# EAGLE design powerTestv1-1 (EAGLE 6.2)
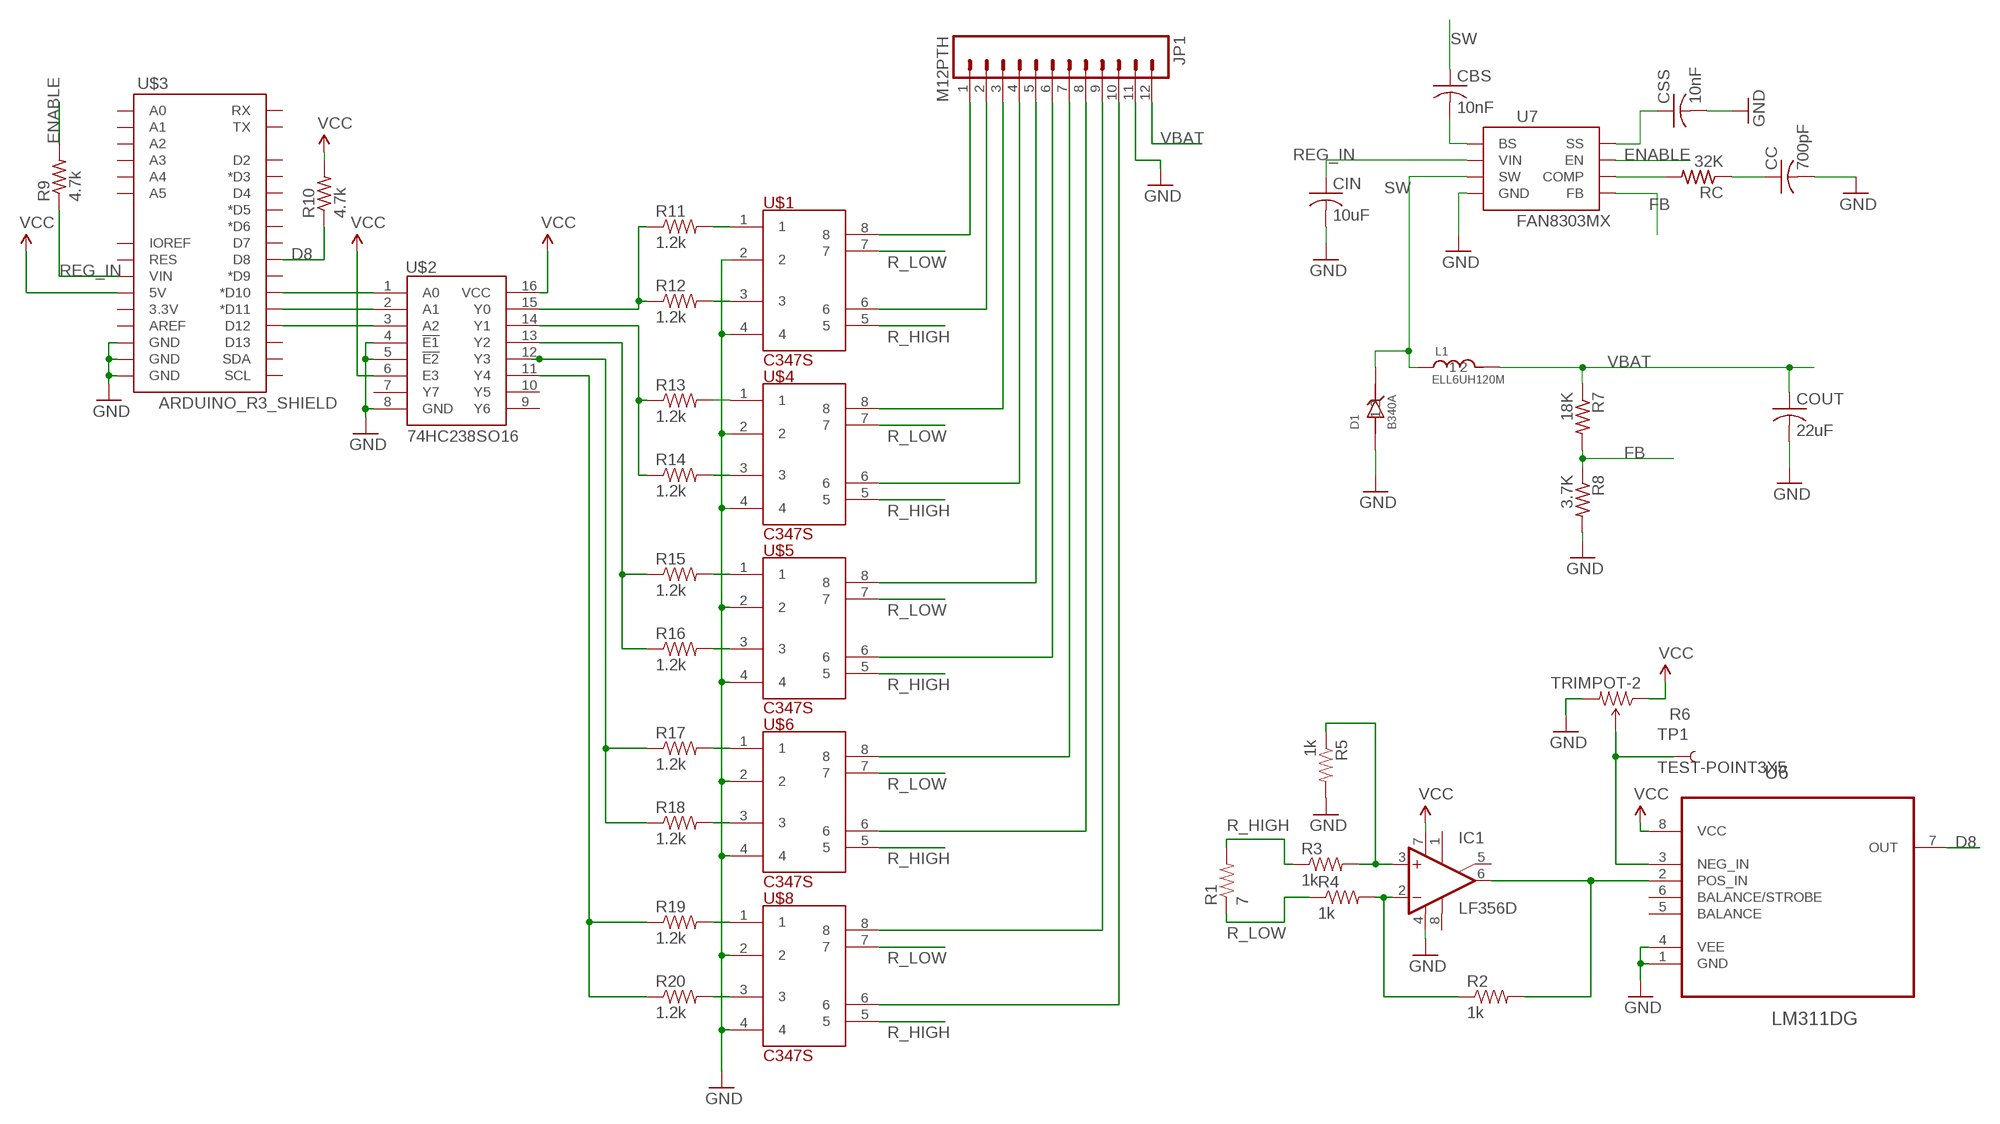
[diagram p0: schematic, sheet 1]

## Parts
CBS  10nF  C-USC0603  [C0603]
CC  700pF  C-USC0603  [C0603]
CIN  10uF  C-USC0603  [C0603]
COUT  22uF  C-USC0603  [C0603]
CSS  10nF  C-USC0603  [C0603]
D1  B340A  [B340A]
IC1  LF356D  [SO08]
JP1  M12PTH  [1X12]
L1  ELL6UH120M  [ELL6UH120M]
R1  7  RESISTORPTH-2W  [AXIAL-0.8]
R2  1k  RESISTOR0603-RES  [0603-RES]
R3  1k  RESISTOR0603-RES  [0603-RES]
R4  1k  RESISTOR0603-RES  [0603-RES]
R5  1k  RESISTOR0603-RES  [0603-RES]
R6  TRIMPOT-2  [TRIMPOT_TC33]
R7  18K  R-US_R0603  [R0603]
R8  3.7K  R-US_R0603  [R0603]
R9  4.7k  R-US_R0603  [R0603]
R10  4.7k  R-US_R0603  [R0603]
R11  1.2k  RESISTOR0603-RES  [0603-RES]
R12  1.2k  RESISTOR0603-RES  [0603-RES]
R13  1.2k  RESISTOR0603-RES  [0603-RES]
R14  1.2k  RESISTOR0603-RES  [0603-RES]
R15  1.2k  RESISTOR0603-RES  [0603-RES]
R16  1.2k  RESISTOR0603-RES  [0603-RES]
R17  1.2k  RESISTOR0603-RES  [0603-RES]
R18  1.2k  RESISTOR0603-RES  [0603-RES]
R19  1.2k  RESISTOR0603-RES  [0603-RES]
R20  1.2k  RESISTOR0603-RES  [0603-RES]
RC  32K  R-US_R0603  [R0603]
TP1  TEST-POINT3X5  [PAD.03X.05]
U6  LM311DG  [SOIC127P600X175-8N]
U7  FAN8303MX  [FAN8303MX]
U$1  C347S  [SOP8]
U$2  74HC238SO16  [SO16]
U$3  ARDUINO_R3_SHIELD  [UNO_R3_SHIELD]
U$4  C347S  [SOP8]
U$5  C347S  [SOP8]
U$6  C347S  [SOP8]
U$8  C347S  [SOP8]

## Nets
D8: R10.1 U6.7(OUT) U$3.D8
ENABLE: R9.2 U7.P$7(EN)
FB: R7.2 R8.1 U7.P$5(FB)
GND [power]: CC.2 CIN.2 COUT.2 CSS.2 D1.P$1 IC1.4(V-) JP1.11 R5.2 R6.3(CW) R8.2 U6.1(GND) U6.4(VEE) U7.P$4(GND) U$1.2 U$1.4 U$2.4(!E1) U$2.5(!E2) U$2.8(GND) U$3.GND@0(GND) U$3.GND@1(GND) U$3.GND@2(GND) U$4.2 U$4.4 U$5.2 U$5.4 U$6.2 U$6.4 U$8.2 U$8.4
N$1: U$2.1(A0) U$3.D10(*D10)
N$2: U$2.2(A1) U$3.D11(*D11)
N$3: U$2.3(A2) U$3.D12
N$6: R12.2 U$1.3
N$7: R14.2 U$4.3
N$8: R15.2 U$5.1
N$9: R16.2 U$5.3
N$11: R11.2 U$1.1
N$12: R17.2 U$6.1
N$13: R18.2 U$6.3
N$14 [high_i]: JP1.1 U$1.8
N$15 [high_i]: JP1.2 U$1.6
N$16 [high_i]: JP1.3 U$4.8
N$17 [high_i]: JP1.4 U$4.6
N$18 [high_i]: JP1.5 U$5.8
N$19 [high_i]: JP1.6 U$5.6
N$20: IC1.2(-IN) R2.1 R4.2
N$21: IC1.6(OUT) R2.2 U6.2(POS_IN)
N$22 [high_i]: JP1.7 U$6.8
N$23 [high_i]: JP1.8 U$6.6
N$24 [high_i]: JP1.9 U$8.8
N$25: IC1.3(+IN) R3.2 R5.1
N$26: R6.2(WIPER) TP1.P$1 U6.3(NEG_IN)
N$27: CSS.1 U7.P$8(SS)
N$28: CBS.2 U7.P$1(BS)
N$29: RC.2 U7.P$6(COMP)
N$30: CC.1 RC.1
N$31 [high_i]: JP1.10 U$8.6
N$32: R13.2 U$4.1
N$33: R19.2 U$8.1
N$35: R20.2 U$8.3
N$36: R11.1 R12.1 U$2.15(Y0)
N$37: R13.1 R14.1 U$2.14(Y1)
N$38: R15.1 R16.1 U$2.13(Y2)
N$39: R17.1 R18.1 U$2.12(Y3)
N$40: R19.1 R20.1 U$2.11(Y4)
R_HIGH [high_i]: R1.P$2 R3.1 U$1.5 U$4.5 U$5.5 U$6.5 U$8.5
R_LOW [high_i]: R1.P$1 R4.1 U$1.7 U$4.7 U$5.7 U$6.7 U$8.7
REG_IN: CIN.1 R9.1 U7.P$2(VIN) U$3.VIN
SW: CBS.1 D1.P$2 L1.P$1 U7.P$3(SW)
VBAT: COUT.1 JP1.12 L1.P$2 R7.1
VCC: IC1.7(V+) R6.1(CCW) R10.2 U6.8(VCC) U$2.6(E3) U$2.16(VCC) U$3.5V
Unconnected: IC1.1(ON1) IC1.5(ON2) IC1.8(OPT) U6.5(BALANCE) U6.6(BALANCE/STROBE) U$2.7(Y7) U$2.9(Y6) U$2.10(Y5) U$3.3.3V U$3.A0 U$3.A1 U$3.A2 U$3.A3 U$3.A4 U$3.A5 U$3.AREF U$3.D2 U$3.D3(*D3) U$3.D4 U$3.D5(*D5) U$3.D6(*D6) U$3.D7 U$3.D9(*D9) U$3.D13 U$3.IOREF U$3.RES U$3.RX U$3.SCL U$3.SDA U$3.TX

## Library data of the parts
CBS CC CIN COUT CSS = rcl:C-US: CAPACITOR, American symbol
D1 = roblocks:B340A
IC1 = linear:LF356: OP AMP
JP1 = SparkFun-Connectors:M12: Header 12 Standard 12-pin 0.1" header. Use with straight break away headers (SKU : PRT-00116), right angle break away headers (PRT-00553), swiss pins (PRT-00743), machine pins (PRT-00117), and female headers (PRT-00115).
L1 = roblocks:ELL6UH120M
R1 = SparkFun-Resistors:RESISTOR: Resistor Basic schematic elements and footprints for 0603, 1206, and PTH resistors.
R2-R5 R11-R20 = SparkFun-Passives:RESISTOR: Resistor Basic schematic elements and footprints for 0603, 1206, and PTH resistors.
R6 = SparkFun-Electromechanical:TRIMPOT: Various small potentiometers for "set-and-forget" applications
R7-R10 RC = rcl:R-US_: RESISTOR, American symbol
TP1 = SparkFun-Passives:TEST-POINT: Bare copper test points for troubleshooting or ICT
U6 = ON Semiconductor_By_element14_Batch_1:LM311DG: Single Comparators; MPN: LM311DG; OC_FARNELL: 1468705; OC_NEWARK: 98H0570; PACKAGE: SOIC-8; SUPPLIER: Onsemiconductor
U7 = roblocks:FAN8303MX
U$1 U$4-U$6 U$8 = Coto:C347S
U$2 = nxp:74HC238
U$3 = SparkFun-Boards:ARDUINO_R3_SHIELD: Shield form compatible with the Arduino Uno R3.

## Net classes
0 signal: width 0.305 mm, drill 0.305 mm, clearance 0.152 mm
1 power: width 0.381 mm, drill 0.305 mm, clearance 0.152 mm
2 high_i: width 0.381 mm, drill 0.305 mm, clearance 0.152 mm

## Board
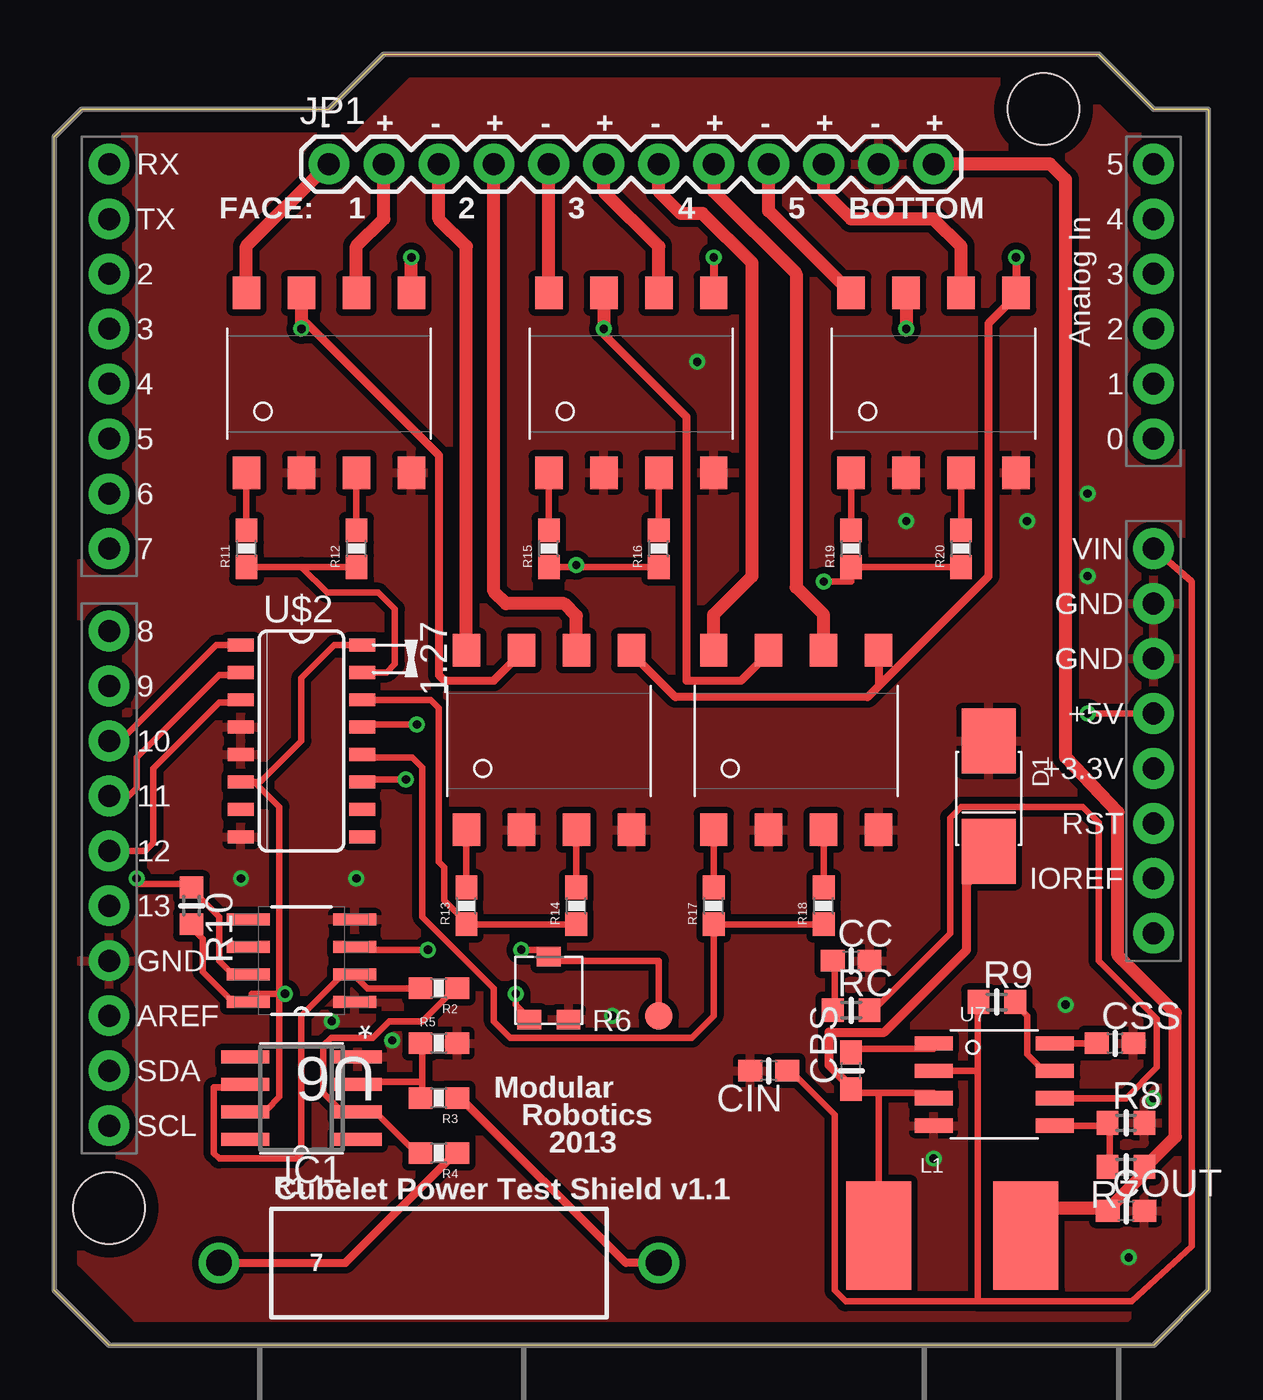
[diagram p1: board, top side]
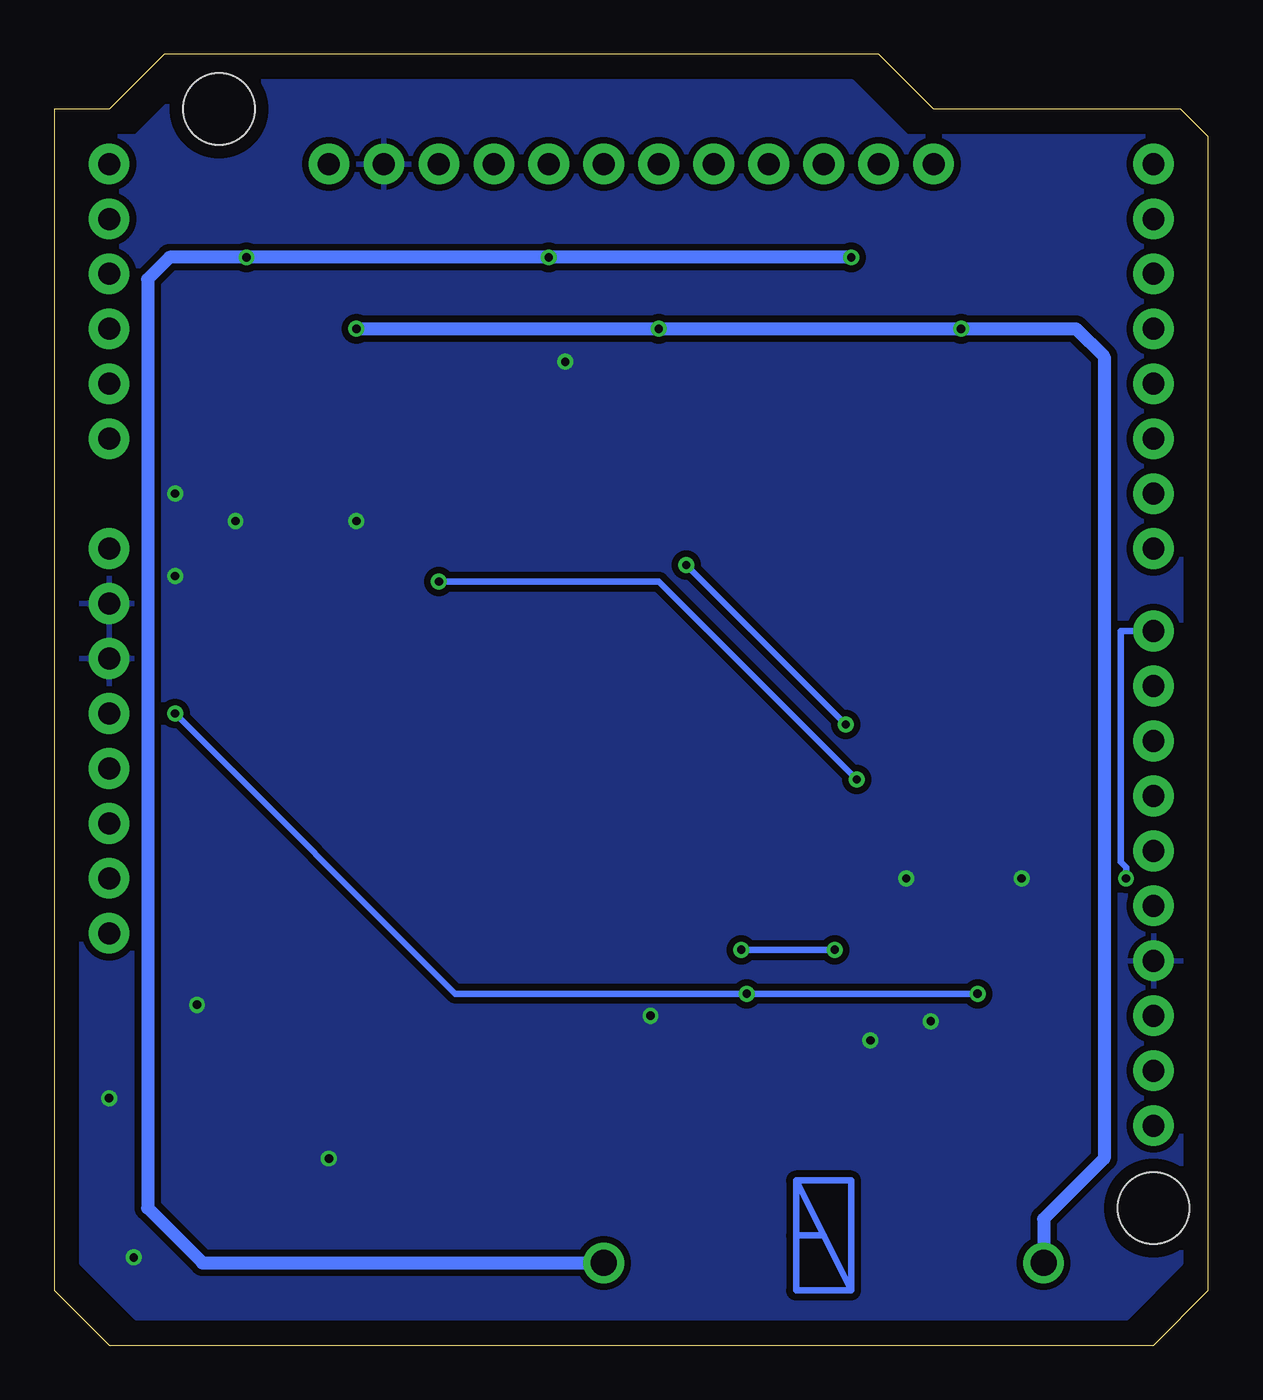
[diagram p2: board, bottom side, seen from below]

Size 53.34 x 59.69 mm. Coordinates in mm from the lower left corner, seen from the top.
Outline: 0,2.54 0,55.88 1.27,57.15 12.7,57.15 15.24,59.69 48.26,59.69 50.8,57.15 53.34,57.15 53.34,2.54 50.8,0 2.54,0 0,2.54
Copper layers (1*16): Top 0.0356mm / dielectric 1.5011mm / Bottom 0.0356mm
Design rules: minimum track width 6mil, minimum drill 13mil, track to track 12mil, track to pad 6mil, pad to pad 6mil, via to via 6mil, smd to smd 6mil, copper to edge 15mil, drill to drill 6mil, minimum pad ring 7mil, minimum via ring 7mil, stop-mask expansion 4mil, vias tented up to drill 0mil, thermal gap 10mil
Holes 3.3 mm at 2.54,6.35 45.72,57.15

### Footprints (pad centres in the part's own frame; a part is rotated, then mirrored left to right if it is on the bottom)
C0603 = smd 1.1 x 1: 1 -0.85,0; 2 0.85,0
B340A = smd 3 x 2.5: P$1 0,0; P$2 5.1,0
SO08 = smd 0.6 x 2.2: 1 -1.905,-2.6; 2 -0.635,-2.6; 3 0.635,-2.6; 4 1.905,-2.6; 5 1.905,2.6; 6 0.635,2.6; 7 -0.635,2.6; 8 -1.905,2.6
1X12 = drill 1.016 pad 1.88: 1 0,0; 2 2.54,0; 3 5.08,0; 4 7.62,0; 5 10.16,0; 6 12.7,0; 7 15.24,0; 8 17.78,0; 9 20.32,0; 10 22.86,0; 11 25.4,0; 12 27.94,0
ELL6UH120M = smd 3 x 5: P$1 0,0; P$2 6.8,0
AXIAL-0.8 = drill 1.2 pad 1.88: P$1 -10.16,0; P$2 10.16,0
0603-RES = smd 1.1 x 1: 1 -0.85,0; 2 0.85,0
TRIMPOT_TC33 = smd 1.1 x 0.9: 1 -0.91,-1.45; 2 0,1.45; 3 0.91,-1.45
R0603 = smd 1 x 1.1: 1 -0.85,0; 2 0.85,0
PAD.03X.05 = smd 1.27 x 1.27: P$1 0,0
SOIC127P600X175-8N = smd 1.981 x 0.559: 1 -2.464,1.905; 2 -2.464,0.635; 3 -2.464,-0.635; 4 -2.464,-1.905; 5 2.464,-1.905; 6 2.464,-0.635; 7 2.464,0.635; 8 2.464,1.905
FAN8303MX = smd 1.75 x 0.65: P$1 0,0; P$2 0,-1.27; P$3 0,-2.54; P$4 0,-3.81; P$5 5.6,-3.81; P$6 5.6,-2.54; P$7 5.6,-1.27; P$8 5.6,0
SOP8 = smd 1.27 x 1.5: 1 -3.81,-4.109; 2 -1.27,-4.109; 3 1.27,-4.109; 4 3.81,-4.109; 5 3.81,4.191; 6 1.27,4.191; 7 -1.27,4.191; 8 -3.81,4.191
SO16 = smd 0.6 x 1.2: 1 -4.445,-2.8; 2 -3.175,-2.8; 3 -1.905,-2.8; 4 -0.635,-2.8; 5 0.635,-2.8; 6 1.905,-2.8; 7 3.175,-2.8; 8 4.445,-2.8; 9 4.445,2.8; 10 3.175,2.8; 11 1.905,2.8; 12 0.635,2.8; 13 -0.635,2.8; 14 -1.905,2.8; 15 -3.175,2.8; 16 -4.445,2.8
UNO_R3_SHIELD = drill 1.016 pad 1.88: 3.3V 50.8,26.67; 5V 50.8,29.21; A0 50.8,41.91; A1 50.8,44.45; A2 50.8,46.99; A3 50.8,49.53; A4 50.8,52.07; A5 50.8,54.61; AREF 2.54,15.24; D2 2.54,49.53; D3 2.54,46.99; D4 2.54,44.45; D5 2.54,41.91; D6 2.54,39.37; D7 2.54,36.83; D8 2.54,33.02; D9 2.54,30.48; D10 2.54,27.94; D11 2.54,25.4; D12 2.54,22.86; D13 2.54,20.32; GND@0 50.8,31.75; GND@1 50.8,34.29; GND@2 2.54,17.78; IOREF 50.8,21.59; NC 50.8,19.05; RES 50.8,24.13; RX 2.54,54.61; SCL 2.54,10.16; SDA 2.54,12.7; TX 2.54,52.07; VIN 50.8,36.83

### Placement (x,y rotation side)
CBS  36.83,12.7 90 top
CC  36.83,17.78 0 top
CIN  33.02,12.7 180 top
COUT  49.53,6.22 0 top
CSS  49.02,13.97 0 top
D1  43.18,27.94 270 top
IC1  11.43,11.43 90 top
JP1  12.7,54.61 0 top
L1  38.1,5.08 0 top
R1  17.78,3.81 0 top
R2  17.78,16.51 180 top
R3  17.78,11.43 180 top
R4  17.78,8.89 180 top
R5  17.78,13.97 0 top
R6  22.86,16.51 0 top
R7  49.53,8.26 180 top
R8  49.53,10.29 0 top
R9  43.56,15.88 0 top
R10  6.35,20.32 270 top
R11  8.89,36.83 90 top
R12  13.97,36.83 90 top
R13  19.05,20.32 90 top
R14  24.13,20.32 90 top
R15  22.86,36.83 90 top
R16  27.94,36.83 90 top
R17  30.48,20.32 90 top
R18  35.56,20.32 90 top
R19  36.83,36.83 90 top
R20  41.91,36.83 90 top
RC  36.83,15.49 0 top
TP1  27.94,15.24 0 top
U6  11.43,17.78 180 top
U7  40.64,13.97 0 top
U$1  12.7,44.45 0 top
U$2  11.43,27.94 270 top
U$3  0,0 0 top
U$4  22.86,27.94 0 top
U$5  26.67,44.45 0 top
U$6  34.29,27.94 0 top
U$8  40.64,44.45 0 top

### Tracks (layer width: path | path; a pad name or v marks a point on that pad's centre or on a via)
D8  (via drill 0.38)
  Top 0.305: U6.7 8.89,17.27 8.13,17.27 7.62,17.78 7.62,19.81 6.35,21.08 R10.1 6.35,21.34 3.81,21.34 v3.81,21.59
  Bottom 0.305: v3.81,21.59 3.81,22.1 4.06,22.35 4.06,33.02 U$3.D8
ENABLE
  Top 0.305: U7.P$7 45.72,12.7 44.96,13.46 44.96,15.24 44.45,15.75 R9.2
FB
  Top 0.305: R7.2 48.77,8.38 48.77,10.16 R8.1 48.55,10.16 U7.P$5
GND  (via drill 0.38)
  Top 0.381: U$5.4 30.48,40.47
  other vias: 47.75,39.37 47.75,35.56 29.72,45.47 13.97,21.59 8.64,21.59 50.8,11.43 46.74,15.75 40.64,8.64 25.78,15.24 15.62,14.1 12.83,14.99 39.37,38.1 44.96,38.1 49.66,4.06
  pour Top (isolate 0.305): 1.27,54.61 2.54,55.88 13.97,55.88 16.51,58.42 46.99,58.42 49.53,55.88 52.07,55.88 52.07,3.81 49.53,1.27 3.81,1.27 1.27,3.81
  pour Bottom (isolate 0.305): 1.27,54.61 2.54,55.88 13.97,55.88 16.51,58.42 46.99,58.42 49.53,55.88 52.07,55.88 52.07,3.81 49.53,1.27 3.81,1.27 1.27,3.81
N$1
  Top 0.305: U$3.D10 3.05,27.94 7.49,32.38 U$2.1
N$2
  Top 0.305: U$2.2 8.5,30.99 7.62,30.99 3.81,27.18 3.81,25.76 3.45,25.4 U$3.D11
N$3
  Top 0.305: U$2.3 8.5,29.72 7.62,29.72 4.57,26.67 4.57,23.22 4.21,22.86 U$3.D12
N$4
  Bottom 0.305: 19.05,7.62 19.05,5.08 | 19.05,5.08 19.05,2.54 16.51,2.54 | 16.51,2.54 16.51,7.62 19.05,7.62 | 19.05,7.62 17.78,5.08 | 17.78,5.08 16.51,2.54 | 19.05,5.08 17.78,5.08
N$6
  Top 0.305: R12.2 U$1.3
N$7
  Top 0.305: R14.2 U$4.3
N$8
  Top 0.305: R15.2 U$5.1
N$9
  Top 0.305: R16.2 U$5.3
N$11
  Top 0.305: R11.2 U$1.1
N$12
  Top 0.305: R17.2 U$6.1
N$13
  Top 0.305: R18.2 U$6.3
N$14
  Top 0.61: U$1.8 8.89,50.8 JP1.1
N$15
  Top 0.61: U$1.6 13.97,50.8 15.24,52.07 JP1.2
N$16
  Top 0.61: U$4.8 19.05,50.8 17.78,52.07 JP1.3
N$17
  Top 0.61: U$4.6 24.13,33.72 23.56,34.29 20.89,34.29 20.32,34.86 JP1.4
N$18
  Top 0.61: U$5.8 JP1.5
N$19
  Top 0.61: U$5.6 27.94,50.8 25.4,53.34 JP1.6
N$20
  Top 0.305: R4.2 16.76,8.89 14.99,10.67 14.22,10.67 IC1.2 13.97,10.92 13.21,10.92 12.45,11.68 12.45,13.87 12.8,14.22 14.73,14.22 15.49,14.99 17.02,14.99 18.54,16.51 R2.1
N$21
  Top 0.305: R2.2 14.48,16.51 13.97,17.02 U6.2 13.72,17.02 13.21,17.02 11.43,15.24 11.43,8.89 11.18,8.64 7.62,8.64 7.37,8.89 7.37,11.94 8.64,11.94 IC1.6
N$22
  Top 0.61: U$6.8 30.48,33.78 32.26,35.56 32.26,50.04 29.97,52.32 28.96,52.32 27.94,53.34 JP1.7
N$23
  Top 0.61: U$6.6 35.56,33.78 34.29,35.05 34.29,49.53 30.48,53.34 JP1.8
N$24
  Top 0.61: U$8.8 33.02,52.45 JP1.9
N$25
  Top 0.305: 17.02,12.19 17.02,13.97 R5.1 | 17.02,12.19 17.02,11.43 R3.2 | 17.02,12.19 14.22,12.19 IC1.3
N$26  (via drill 0.38)
  Top 0.305: TP1.P$1 27.94,17.78 22.86,17.78 R6.2 22.86,18.29 v21.59,18.29 | v17.27,18.29 13.97,18.29 U6.3
  Bottom 0.305: v21.59,18.29 v17.27,18.29
N$27
  Top 0.305: U7.P$8 CSS.1
N$28
  Top 0.305: U7.P$1 40.64,13.72 36.83,13.72 CBS.2
N$29
  Top 0.305: U7.P$6 49.53,11.43 50.95,12.85 50.95,15.09 48.26,17.78 48.26,24.17 47.54,24.89 41.91,24.89 41.4,24.38 41.4,19.05 37.85,15.49 RC.2
N$30
  Top 0.305: RC.1 36.07,15.49 36.07,17.78 CC.1
N$31
  Top 0.61: U$8.6 41.91,50.8 40.64,52.07 36.83,52.07 35.56,53.34 JP1.10
N$32
  Top 0.305: R13.2 U$4.1
N$33
  Top 0.305: R19.2 U$8.1
N$35
  Top 0.305: R20.2 U$8.3
N$36
  Top 0.305: R11.1 11.43,35.98 | 11.43,35.98 R12.1 | U$2.15 15.37,31.11 15.75,31.5 15.75,34.04 14.99,34.8 12.61,34.8 11.43,35.98
N$37
  Top 0.305: R14.1 R13.1 19.05,19.56 18.03,20.57 18.03,22.1 17.78,22.35 17.78,29.46 17.4,29.84 U$2.14
N$38  (via drill 0.38)
  Top 0.305: R15.1 24.13,35.98 | 24.13,35.98 R16.1 | v16.76,28.7 14.48,28.7 U$2.13 | v24.13,36.07 24.13,35.98
  Bottom 0.305: v24.13,36.07 v16.76,28.7
N$39
  Top 0.305: R18.1 R17.1 30.48,15.24 29.46,14.22 21.08,14.22 20.32,14.99 20.32,16.51 17.02,19.81 17.02,26.72 16.56,27.18 14.48,27.18 U$2.12
N$40  (via drill 0.38)
  Top 0.305: R20.1 R19.1 36.83,35.31 v35.56,35.31 | v16.26,26.16 14.48,26.16 U$2.11
  Bottom 0.305: v16.26,26.16 25.4,35.31 v35.56,35.31
R_HIGH  (via drill 0.38)
  Top 0.381: 38.1,30.48 37.59,29.97 28.7,29.97 26.67,32 U$4.5 | U$6.5 38.1,30.48 | 38.1,30.48 43.18,35.56 43.18,47.24 44.45,48.51 U$8.5 v44.45,50.29 | R1.P$2 26.42,3.81 18.8,11.43 R3.1 | v30.48,50.29 U$5.5
  Top 0.61: U$1.5 v16.51,50.29
  Bottom 0.61: v16.51,50.29 v30.48,50.29 v44.45,50.29 48.01,50.29 49.02,49.28 49.02,6.35 46.48,3.81 R1.P$2
R_LOW  (via drill 0.38)
  Top 0.381: R1.P$1 13.46,3.81 18.54,8.89 R4.1 | U$4.7 21.59,32 20.32,30.73 18.03,30.73 17.78,30.99 17.78,41.15 11.68,47.24 v11.43,46.99 | U$6.7 33.02,32 31.75,30.73 29.21,30.73 29.21,42.93 25.4,46.74 v25.4,46.99
  Top 0.61: U$1.7 v11.43,46.99 | U$5.7 v25.4,46.99 | U$8.7 v39.37,46.99
  Bottom 0.61: v39.37,46.99 v25.4,46.99 v11.43,46.99 6.12,46.99 4.83,45.7 4.83,8.64 7.62,5.84 R1.P$1
REG_IN
  Top 0.305: 42.67,2.03 36.58,2.03 36.07,2.54 36.07,10.67 34.04,12.7 CIN.1 | 42.67,12.7 42.67,15.75 R9.1 | 42.67,12.7 42.67,2.03 | 42.67,12.7 U7.P$2 | U$3.VIN 52.58,35.31 52.58,4.57 49.78,2.03 42.67,2.03
SW
  Top 0.305: 38.1,11.68 40.64,11.68 U7.P$3 | 38.1,11.68 36.83,11.68 CBS.1 36.83,11.94 | L1.P$1 38.1,11.68 | 43.18,22.61 D1.P$2
  Top 0.406: 43.18,22.61 42.16,21.34 42.16,18.29 38.35,14.48 35.81,14.48 35.81,12.95 36.83,11.94
VBAT
  Top 0.305: 50.29,7.87 50.29,8.13 R7.1 50.55,8.38 | 48.77,6.35 COUT.1 48.55,6.35 | 44.96,6.35 44.96,5.08 L1.P$2
  Top 0.61: 50.29,7.87 48.77,6.35 | JP1.12 46.02,54.61 46.74,53.89 46.74,27.18 49.15,24.64 49.15,18.03 51.82,15.37 51.82,9.65 50.55,8.38 | 44.96,6.35 48.55,6.35
VCC  (via drill 0.38)
  Top 0.305: U$2.6 9.4,26.04 | 9.4,26.04 9.53,26.04 11.43,27.94 11.43,30.86 12.95,32.38 U$2.16 | R10.2 6.35,19.3 6.86,18.8 6.86,17.27 8.13,16 8.89,16 U6.8 9.14,16 9.14,16.26 10.41,16.26 | v21.34,16.26 21.34,15.75 21.84,15.24 R6.1 | 10.41,16.26 10.41,11.49 9.85,10.92 8.89,10.92 IC1.7 | v47.75,29.21 U$3.5V | 10.41,16.26 10.41,24.89 9.4,25.91 9.4,26.04 | 10.41,16.26 v10.67,16.26
  Bottom 0.305: v10.67,16.26 v21.34,16.26 34.8,16.26 v47.75,29.21

### Text on the board
tPlace: - | + | - | + | - | + | - | + | - | + | - | + | FACE: | 1 | 2 | 3 | 4 | 5 | BOTTOM | Modular | Robotics | 2013 | Cubelet Power Test Shield v1.1